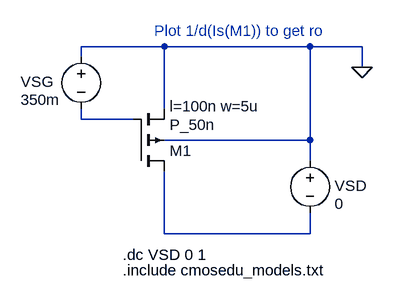
[diagram p0: schematic Fig9_32_PMOS.asc]
Fig9_32_PMOS.asc, the LTspice schematic file:
Version 4
SHEET 1 1224 688
WIRE 448 16 320 16
WIRE 672 16 448 16
WIRE 752 16 672 16
WIRE 320 32 320 16
WIRE 752 48 752 16
WIRE 448 112 448 16
WIRE 320 128 320 112
WIRE 400 128 320 128
WIRE 672 160 672 16
WIRE 672 160 448 160
WIRE 672 192 672 160
WIRE 448 304 448 208
WIRE 672 304 672 272
WIRE 672 304 448 304
FLAG 752 48 0
SYMBOL voltage 320 16 R0
WINDOW 0 -93 54 Left 2
WINDOW 3 -93 82 Left 2
WINDOW 123 0 0 Left 2
WINDOW 39 0 0 Left 2
SYMATTR InstName VSG
SYMATTR Value 350m
SYMBOL voltage 672 176 R0
WINDOW 123 0 0 Left 2
WINDOW 39 0 0 Left 2
WINDOW 0 38 54 Left 2
WINDOW 3 38 82 Left 2
SYMATTR InstName VSD
SYMATTR Value 0
SYMBOL pmos4 400 208 M180
WINDOW 123 56 100 Left 2
SYMATTR Value2 l=100n w=5u
SYMATTR InstName M1
SYMATTR Value P_50n
TEXT 384 336 Left 2 !.dc VSD 0 1
TEXT 384 360 Left 2 !.include cmosedu_models.txt
TEXT 432 -8 Left 2 ;Plot 1/d(Is(M1)) to get ro

The netlist it stands for:
* Fig9_32_PMOS.asc
VSG 0 N001 350m
VSD 0 N002 0
M1 N002 N001 0 0 P_50n l=100n w=5u
.model NMOS NMOS
.model PMOS PMOS
.lib standard.mos
.dc VSD 0 1
.include cmosedu_models.txt
* Plot 1/d(Is(M1)) to get ro
.backanno
.end